# Altium schematic sheet Power_MPU.SchDoc: Power_MPU
size A3; CompanyName: STMicroelectronics; SheetNumber: 4; SheetTotal: 7
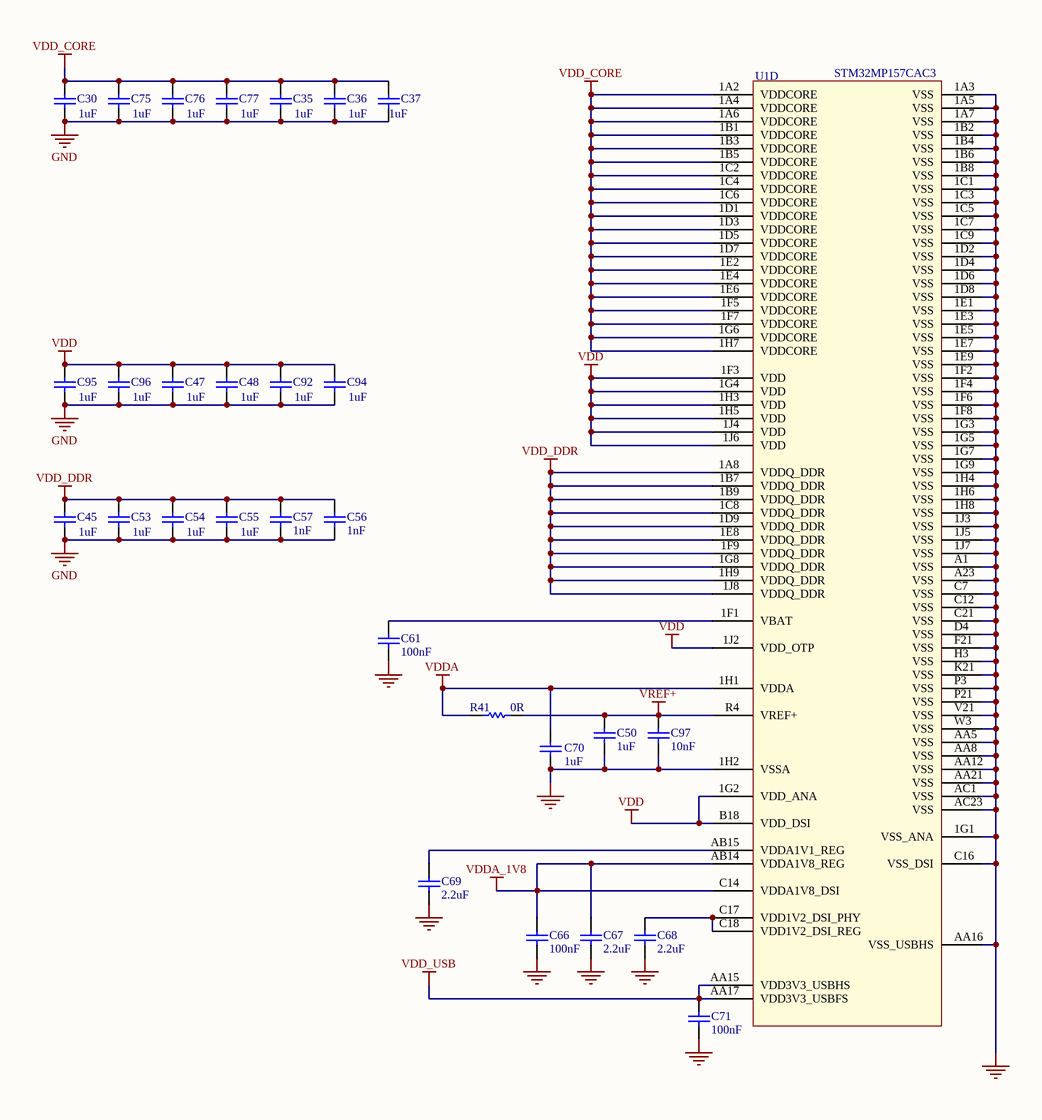
[diagram p0: Power_MPU.SchDoc]

## Parts
C30  value 1uF  [C0402]  (hidden comment: Capacitor)
C35  value 1uF  [C0402]  (hidden comment: Capacitor)
C36  value 1uF  [C0402]  (hidden comment: Capacitor)
C37  value 1uF  [C0402]  (hidden comment: Capacitor)
C45  value 1uF  [C0402]  (hidden comment: Capacitor)
C47  value 1uF  [C0402]  (hidden comment: Capacitor)
C48  value 1uF  [C0402]  (hidden comment: Capacitor)
C50  value 1uF  [C0402]
C53  value 1uF  [C0402]  (hidden comment: Capacitor)
C54  value 1uF  [C0402]  (hidden comment: Capacitor)
C55  value 1uF  [C0402]  (hidden comment: Capacitor)
C56  value 1nF  [C0402]
C57  value 1nF  [C0402]
C61  value 100nF  [C0402]
C66  value 100nF  [C0402]  (hidden comment: Capacitor)
C67  value 2.2uF  [C0402]  (hidden comment: Capacitor)
C68  value 2.2uF  [C0402]  (hidden comment: Capacitor)
C69  value 2.2uF  [C0402]  (hidden comment: Capacitor)
C70  value 1uF  [C0402]
C71  value 100nF  [C0402]
C75  value 1uF  [C0402]  (hidden comment: Capacitor)
C76  value 1uF  [C0402]  (hidden comment: Capacitor)
C77  value 1uF  [C0402]  (hidden comment: Capacitor)
C92  value 1uF  [C0402]  (hidden comment: Capacitor)
C94  value 1uF  [C0402]  (hidden comment: Capacitor)
C95  value 1uF  [C0402]  (hidden comment: Capacitor)
C96  value 1uF  [C0402]  (hidden comment: Capacitor)
C97  value 10nF  [C0402]  (hidden comment: Capacitor)
R41  value 0R  [R0402]
U1  STM32MP157CAC3  [ICC_TFBGA361_12X12_STM32MP157CAC3_P050-065]  (part D of 5)

## Nets
GND: C30.1 C35.1 C36.1 C37.1 C45.1 C47.1 C48.1 C50.1 C53.1 C54.1 C55.1 C56.1 C57.1 C61.1 C66.1 C67.1 C68.1 C69.1 C70.1 C71.1 C75.1 C76.1 C77.1 C92.1 C94.1 C95.1 C96.1 C97.1 U1.1A3(VSS) U1.1A5(VSS) U1.1A7(VSS) U1.1B2(VSS) U1.1B4(VSS) U1.1B6(VSS) U1.1B8(VSS) U1.1C1(VSS) U1.1C3(VSS) U1.1C5(VSS) U1.1C7(VSS) U1.1C9(VSS) U1.1D2(VSS) U1.1D4(VSS) U1.1D6(VSS) U1.1D8(VSS) U1.1E1(VSS) U1.1E3(VSS) U1.1E5(VSS) U1.1E7(VSS) U1.1E9(VSS) U1.1F2(VSS) U1.1F4(VSS) U1.1F6(VSS) U1.1F8(VSS) U1.1G1(VSS_ANA) U1.1G3(VSS) U1.1G5(VSS) U1.1G7(VSS) U1.1G9(VSS) U1.1H2(VSSA) U1.1H4(VSS) U1.1H6(VSS) U1.1H8(VSS) U1.1J3(VSS) U1.1J5(VSS) U1.1J7(VSS) U1.A1(VSS) U1.A23(VSS) U1.AA5(VSS) U1.AA8(VSS) U1.AA12(VSS) U1.AA16(VSS_USBHS) U1.AA21(VSS) U1.AC1(VSS) U1.AC23(VSS) U1.C7(VSS) U1.C12(VSS) U1.C16(VSS_DSI) U1.C21(VSS) U1.D4(VSS) U1.F21(VSS) U1.H3(VSS) U1.K21(VSS) U1.P3(VSS) U1.P21(VSS) U1.V21(VSS) U1.W3(VSS)
VDD: C47.2 C48.2 C92.2 C94.2 C95.2 C96.2 U1.1F3(VDD) U1.1G2(VDD_ANA) U1.1G4(VDD) U1.1H3(VDD) U1.1H5(VDD) U1.1J2(VDD_OTP) U1.1J4(VDD) U1.1J6(VDD) U1.B18(VDD_DSI)
VDD_CORE: C30.2 C35.2 C36.2 C37.2 C75.2 C76.2 C77.2 U1.1A2(VDDCORE) U1.1A4(VDDCORE) U1.1A6(VDDCORE) U1.1B1(VDDCORE) U1.1B3(VDDCORE) U1.1B5(VDDCORE) U1.1C2(VDDCORE) U1.1C4(VDDCORE) U1.1C6(VDDCORE) U1.1D1(VDDCORE) U1.1D3(VDDCORE) U1.1D5(VDDCORE) U1.1D7(VDDCORE) U1.1E2(VDDCORE) U1.1E4(VDDCORE) U1.1E6(VDDCORE) U1.1F5(VDDCORE) U1.1F7(VDDCORE) U1.1G6(VDDCORE) U1.1H7(VDDCORE)
VDD_DDR: C45.2 C53.2 C54.2 C55.2 C56.2 C57.2 U1.1A8(VDDQ_DDR) U1.1B7(VDDQ_DDR) U1.1B9(VDDQ_DDR) U1.1C8(VDDQ_DDR) U1.1D9(VDDQ_DDR) U1.1E8(VDDQ_DDR) U1.1F9(VDDQ_DDR) U1.1G8(VDDQ_DDR) U1.1H9(VDDQ_DDR) U1.1J8(VDDQ_DDR)
VDD_USB: C71.2 U1.AA15(VDD3V3_USBHS) U1.AA17(VDD3V3_USBFS)
VDDA: C70.2 R41.1 U1.1H1(VDDA)
VDDA_1V8: C66.2 C67.2 U1.AB14(VDDA1V8_REG) U1.C14(VDDA1V8_DSI)
VREF+: C50.2 C97.2 R41.2 U1.R4(VREF+)
NetC61_2: C61.2 U1.1F1(VBAT)
NetC68_2: C68.2 U1.C17(VDD1V2_DSI_PHY) U1.C18(VDD1V2_DSI_REG)
NetC69_2: C69.2 U1.AB15(VDDA1V1_REG)

## Notes on the sheet
- Title:
- Project:
- Size:
- Revision:
- Variant:
- A3
- -
- Date:
- Reference:
- Sheet:
- of

## Library data of the parts
C30 C35-C37 C45 C47 C48 C53-C55 C75-C77 C92 C94-C96 = MCD-00095: Capacitor,1uF,6V3,X5R,10%,0402; Manufacturer_Part_Number: GRM155R60J105KE19; Manufacturer: MURATA; ECCN_US: EAR99; ECCN_EU: NEC; Provided_By: Subcon; Internal_Part_Number: MCD-00095; Status: Released; PartType: Capacitors; Package: C0402; ComponentLink1Description: GRM155R60J105KE1
C50 C70 = MCD-00095: Capacitor,1uF,6V3,X5R,10%,0402; Manufacturer_Part_Number: GRM155R60J105KE19; Manufacturer: MURATA; ECCN_US: EAR99; ECCN_EU: NEC; Provided_By: Subcon; Initial_Board_Reference: MB1262; Internal_Part_Number: MCD-00095; Status: Released; Part_Type: Capacitor; Package: C0402; ComponentLink1Description: Murata_Capacitor_GR_series.pdf; ComponentLink1URL: http://tunmcdsvn.tun.st.com/Component_Datasheet_Library/Trunk/Capacitors/Murata_Capacitor_GR_series
C56 C57 = MCD-00198: Capacitor,1nF,16V,X7R,10%,0402; Manufacturer_Part_Number: CC0402KRX7R7BB102; Manufacturer: YAGEO; Provided_By: Subcon; Internal_Part_Number: MCD-00198; Status: Released; Part_Type: Capacitor; Package: C0402; ComponentLink1Description: Yageo_Capacitor_X7R-series.pdf; ComponentLink1URL: http://tunmcdsvn.tun.st.com/Component_Datasheet_Library/Trunk/Capacitors/Yageo_Multilayer_Capacitor_X7R_series_100pF_to_22uF
C61 C71 = MCD-00006: Capacitor,100nF,16V,X7R,10%,0402; Manufacturer_Part_Number: CC0402KRX7R7BB104; Manufacturer: YAGEO; Provided_By: Subcon; Initial_Board_Reference: MB1274; Internal_Part_Number: MCD-00006; ComponentLink1Description: Yageo_Capacitor_X7R-series.pdf; ECCN_US: n/a; ECCN_EU: n/a; Status: Released; Part_Type: Capacitor; Package: C0402; ComponentLink1URL: http://tunmcdsvn.tun.st.com/Component_Datasheet_Library/Trunk/Capacitors/Yageo_Multilayer_Capacitor_X7R_series_100pF_to_22uF
C66 = MCD-00006: Capacitor, MLCC, 100nF, 16V, X7R, 10%, 0402, T=0.5mm; Manufacturer_Part_Number: CC0402KRX7R7BB104; Manufacturer: YAGEO; Alternate_Manufacturer_Part_Number: GCM155R71C104KA55D; Alternate_Manufacturer: MURATA; ECCN_US: EAR99; ECCN_EU: NEC; Provided_By: SUBCO; Internal_Part_Number: MCD-00006; Status: Released; Part_Type: Capacitor; Package: C0402; ComponentLink1Description: Datasheet; ComponentLink1URL: http://tunmcdsvn.tun.st.com/Component_Datasheet_Library/Trunk/Capacitors/Yageo_Multilayer_Capacitor_X7R_series_100pF_to_22uF
C67-C69 = MCD-01823: Capacitor,MLCC,2.2uF,6V3,X5R,10%,0402,T=0.5; Manufacturer_Part_Number: GRM155R60J225KE95D; Manufacturer: MURATA; ECCN_US: EAR99; ECCN_EU: NEC; Provided_By: SUBCO; Internal_Part_Number: MCD-01823; Status: Checked; Part_Type: Capacitor; Package: C0402; ComponentLink1Description: Datasheet; ComponentLink1URL: http://tunmcdsvn.tun.st.com/Component_Datasheet_Library/Trunk/Capacitors/Murata_Capacitor_GR_series
C97 = MCD-00011: Capacitor, MLCC, 10nF, 16V, X7R, 10%, 0402, T=0.5mm; Manufacturer_Part_Number: CC0402KRX7R7BB103; Manufacturer: YAGEO; ECCN_US: EAR99; ECCN_EU: NEC; Provided_By: SUBCO; Internal_Part_Number: MCD-00011; Status: Released; Part_Type: Capacitor; Package: C0402; ComponentLink1Description: Datasheet; ComponentLink1URL: http://tunmcdsvn.tun.st.com/Component_Datasheet_Library/Trunk/Capacitors/Yageo_Multilayer_Capacitor_X7R_series_100pF_to_22uF
R41 = MCD-00052: Resistor,0R,0402,5%,1/16W; Manufacturer_Part_Number: RC0402JR-070RL; Manufacturer: YAGEO; Provided_By: Subcon; Initial_Board_Reference: MB1274; Internal_Part_Number: MCD-00052; Status: Released; Part_Type: Resistor; ComponentLink1Description: Yageo_Resistor_RC0402-series.pdf; ECCN_US: n/a; ECCN_EU: n/a; ComponentLink1URL: http://tunmcdsvn.tun.st.com/Component_Datasheet_Library/Trunk/Resistors/Yageo_Resistor_RC0402-series; Package: R0402
U1 = MCD-00677: MPU TFBGA12x12 secure boot+crypto; Part_Type: IC; Manufacturer: STMICROELECTRONICS; ECCN_US: TBD; Provided_By: STM; Initial_Board_Reference: MB1272; Internal_Part_Number: MCD-00677; Value: STM32MP157CAC3; Status: Footprint available; Manufacturer_Part_Number: STM32MP157CAC3; ComponentLink1Description: TBD; ComponentLink1URL: http://TBD; ECCN_EU: TBD